# Altium project BLE_PGN.PrjPcb
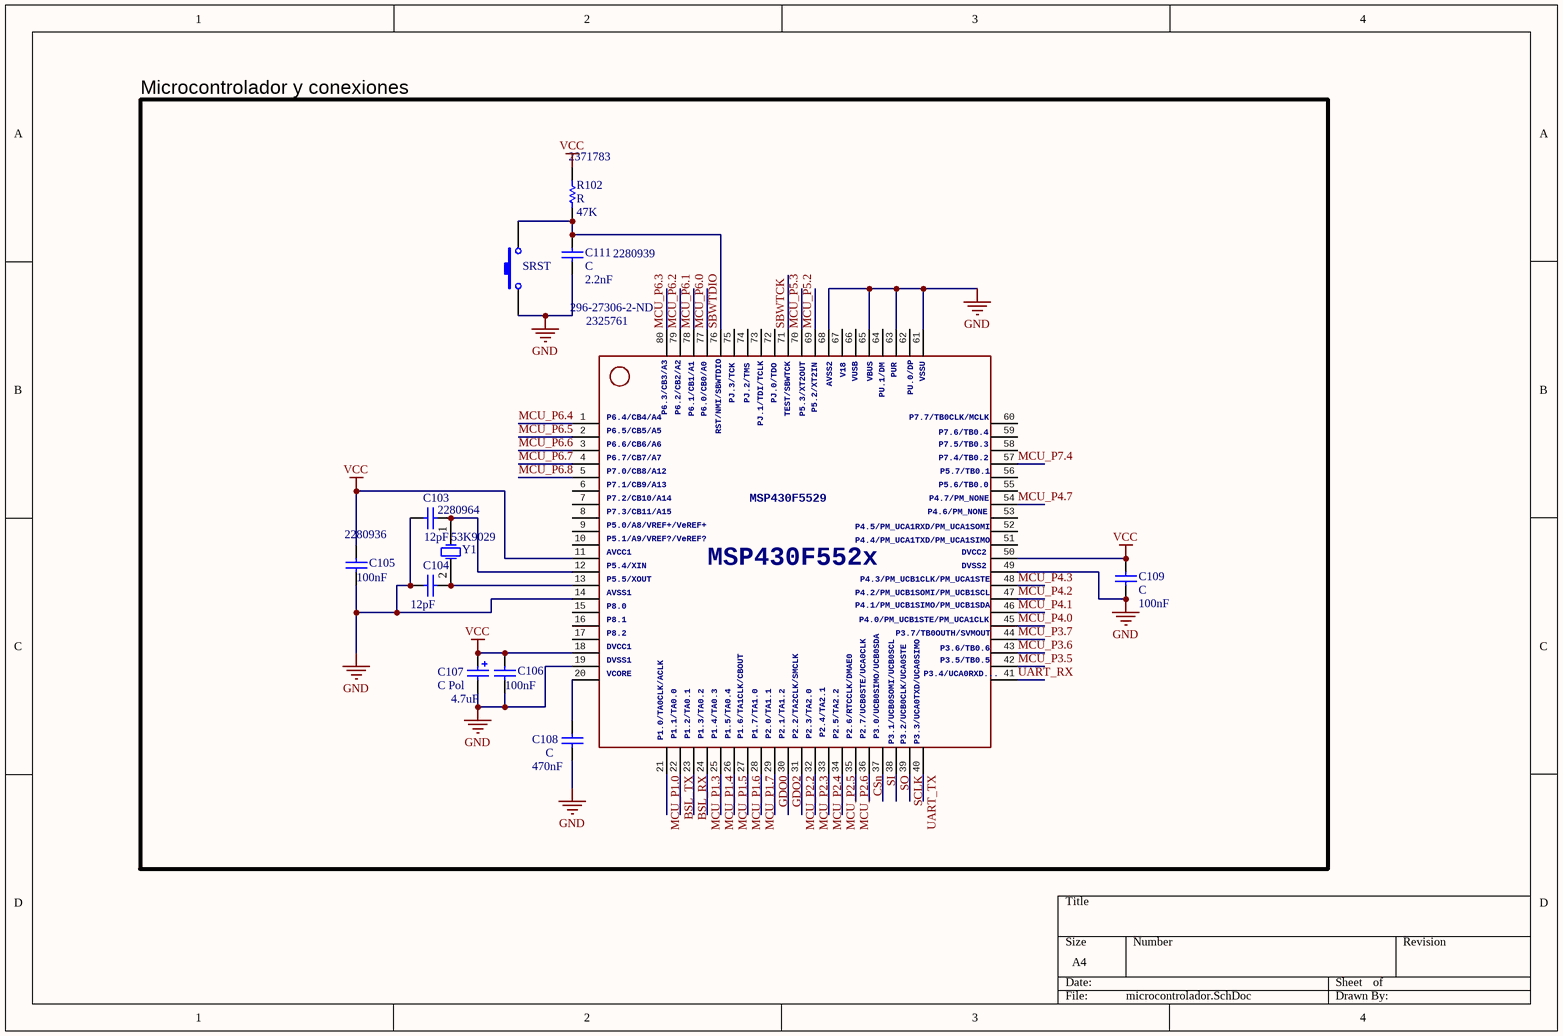
[diagram p0: microcontrolador.SchDoc]
5 sheets, 66 parts. Net scope: global (net labels, ports and power ports of the same name join across sheets).
Board file: blePGN.PcbDoc
Sheets:
  microcontrolador.SchDoc
  alimentacion.SchDoc
  headers_botones.SchDoc
  moduloTransceptorRF.SchDoc
  hm10.SchDoc

## Sheet microcontrolador.SchDoc
size A4

### Parts
C103  value 12pF  Supplier Part Number 1: 2280964  [0805 CAP]  (hidden comment: C)
C104  value 12pF  [0805 CAP]  (hidden comment: C)
C105  value 100nF  Supplier Part Number 2: 2280936  [0805 CAP]  (hidden comment: C)
C106  value 100nF  [0805 CAP]  (hidden comment: C)
C107  C Pol  value 4.7uF  [0805]
C108  C  value 470nF  [0805 CAP]
C109  C  value 100nF  [0805 CAP]
C111  C  value 2.2nF  Supplier Part Number 1: 2280939  [0805 CAP]
MSP430F5529  P3.4/UCA...: P3.4/UCA0RXD...  Supplier Part Number 1: 2325761  Supplier Part Number 2: 296-27306-2-ND  [TI-PN80_N]  (hidden comment: MSP430F5529IPNR)
R102  R  value 47K  Supplier Part Number 1: 2371783  [0805 RES]
SRST  Pulsador  [B3U-1000P]  (value not drawn)
Y1  Supplier Part Number 1: 53K9029  [R38]  (hidden comment: XTAL_CFPX-157_32.768K_SMD)

### Blocks framed on the sheet
Microcontrolador y conexiones: C103-C109 C111 MSP430F5529 R102 SRST Y1

### Nets
GND: C103.1 C104.1 C105.2 C106.2 C107.2 C108.1 C109.1 C111.1 MSP430F5529.14 MSP430F5529.19 MSP430F5529.49 MSP430F5529.61 MSP430F5529.63 MSP430F5529.65 MSP430F5529.68 SRST.1
VCC: C105.1 C106.1 C107.1 C109.2 MSP430F5529.11 MSP430F5529.18 MSP430F5529.50 R102.2
BSL_RX: MSP430F5529.23
BSL_TX: MSP430F5529.22
CSn: MSP430F5529.36
GDO0: MSP430F5529.29
GDO2: MSP430F5529.30
MCU_P1.0: MSP430F5529.21
MCU_P1.3: MSP430F5529.24
MCU_P1.4: MSP430F5529.25
MCU_P1.5: MSP430F5529.26
MCU_P1.6: MSP430F5529.27
MCU_P1.7: MSP430F5529.28
MCU_P2.2: MSP430F5529.31
MCU_P2.3: MSP430F5529.32
MCU_P2.4: MSP430F5529.33
MCU_P2.5: MSP430F5529.34
MCU_P2.6: MSP430F5529.35
MCU_P3.5: MSP430F5529.42
MCU_P3.6: MSP430F5529.43
MCU_P3.7: MSP430F5529.44
MCU_P4.0: MSP430F5529.45
MCU_P4.1: MSP430F5529.46
MCU_P4.2: MSP430F5529.47
MCU_P4.3: MSP430F5529.48
MCU_P4.7: MSP430F5529.54
MCU_P5.2: MSP430F5529.69
MCU_P5.3: MSP430F5529.70
MCU_P6.0: MSP430F5529.77
MCU_P6.1: MSP430F5529.78
MCU_P6.2: MSP430F5529.79
MCU_P6.3: MSP430F5529.80
MCU_P6.4: MSP430F5529.1
MCU_P6.5: MSP430F5529.2
MCU_P6.6: MSP430F5529.3
MCU_P6.7: MSP430F5529.4
MCU_P6.8: MSP430F5529.5
MCU_P7.4: MSP430F5529.57
SBWTCK: MSP430F5529.71
SBWTDIO: C111.2 MSP430F5529.76 R102.1 SRST.2
SCLK: MSP430F5529.39
SI: MSP430F5529.37
SO: MSP430F5529.38
UART_RX: MSP430F5529.41
UART_TX: MSP430F5529.40
NetC103_2: C103.2 MSP430F5529.12 Y1.1(OSC1)
NetC104_2: C104.2 MSP430F5529.13 Y1.2(OSC2)
NetC108_2: C108.2 MSP430F5529.20

Not connected (* = marked no-connect by the designer): MSP430F5529 6 7 8 9 10 15 16 17 51 52 53 55 56 58 59 60 62 64 66 67 72 73 74 75

### Library data of the parts
C103-C106 C108 C109 C111 = C: Capacitor; Manufacturer: Generic Components; Class: Passive; Published: 08/06/2000; Publisher: Altium Hobart Technology Centre; SubClass: Capacitor
  C103 C111: Supplier 1: Farnell
  C105: Supplier 1: Farnell; Supplier 2: Farnell
C107 = C Pol: Polarized Capacitor (Surface Mount); Manufacturer: Generic Components; Class: Passive; Published: 08/06/2000; Publisher: Altium Hobart Technology Centre; SubClass: Capacitor
MSP430F5529 = F552X---PN80: ***MSP430F552X***PN80 / http://www.ti.com/lit/gpn/msp430f5529 / Rev1.0 06/2010    For F552X where X is 1,5,7,9; P6.3/CB3/A3: P6.3/CB3/A3; P6.2/CB2/A2: P6.2/CB2/A2; P6.1/CB1/A1: P6.1/CB1/A1; P6.0/CB0/A0: P6.0/CB0/A0; PJ.3/TCK: PJ.3/TCK; PJ.2/TMS: PJ.2/TMS; PJ.1/TDI/TCLK: PJ.1/TDI/TCLK; PJ.0/TDO: PJ.0/TDO; TEST/SBWTCK: TEST/SBWTCK; P5.3/XT2OUT: P5.3/XT2OUT; P5.2/XT2IN: P5.2/XT2IN; AVSS2: AVSS2; V18: V18; VUSB: VUSB; VBUS: VBUS; PU.1/DM: PU.1/DM; PUR: PUR; PU.0/DP: PU.0/DP; VSSU: VSSU; RST/NMI/SBWTDIO: RST/NMI/SBWTDIO; P7.7/TB0CLK/MCLK: P7.7/TB0CLK/MCLK; P7.6/TB0.4: P7.6/TB0.4; P7.5/TB0.3: P7.5/TB0.3; P7.4/TB0.2: P7.4/TB0.2; P5.7/TB0.1: P5.7/TB0.1; P5.6/TB0.0: P5.6/TB0.0; P4.7/PM_NONE: P4.7/PM_NONE; P4.5/PM_UCA1RXD/PM_UCA1SOMI: P4.5/PM_UCA1RXD/PM_UCA1SOMI; P4.4/PM_UCA1TXD/PM_UCA1SIMO: P4.4/PM_UCA1TXD/PM_UCA1SIMO; DVCC2: DVCC2; P4.3/PM_UCB1CLK/PM_UCA1STE: P4.3/PM_UCB1CLK/PM_UCA1STE; P4.2/PM_UCB1SOMI/PM_UCB1SCL: P4.2/PM_UCB1SOMI/PM_UCB1SCL; P4.1/PM_UCB1SIMO/PM_UCB1SDA: P4.1/PM_UCB1SIMO/PM_UCB1SDA; P4.0/PM_UCB1STE/PM_UCA1CLK: P4.0/PM_UCB1STE/PM_UCA1CLK; P3.7/TB0OUTH/SVMOUT: P3.7/TB0OUTH/SVMOUT; P3.6/TB0.6: P3.6/TB0.6; P4.6/PM_NONE: P4.6/PM_NONE; P3.5/TB0.5: P3.5/TB0.5; P1.0/TA0CLK/ACLK: P1.0/TA0CLK/ACLK; P1.1/TA0.0: P1.1/TA0.0; P1.2/TA0.1: P1.2/TA0.1; P1.3/TA0.2: P1.3/TA0.2; P1.4/TA0.3: P1.4/TA0.3; P1.5/TA0.4: P1.5/TA0.4; P1.6/TA1CLK/CBOUT: P1.6/TA1CLK/CBOUT; P1.7/TA1.0: P1.7/TA1.0; P2.0/TA1.1: P2.0/TA1.1; P2.1/TA1.2: P2.1/TA1.2; P2.2/TA2CLK/SMCLK: P2.2/TA2CLK/SMCLK; P2.4/TA2.1: P2.4/TA2.1; P2.5/TA2.2: P2.5/TA2.2; P2.6/RTCCLK/DMAE0: P2.6/RTCCLK/DMAE0; P2.7/UCB0STE/UCA0CLK: P2.7/UCB0STE/UCA0CLK; P3.0/UCB0SIMO/UCB0SDA: P3.0/UCB0SIMO/UCB0SDA; P3.1/UCB0SOMI/UCB0SCL: P3.1/UCB0SOMI/UCB0SCL; P3.2/UCB0CLK/UCA0STE: P3.2/UCB0CLK/UCA0STE; P3.3/UCA0TXD/UCA0SIMO: P3.3/UCA0TXD/UCA0SIMO; P6.4/CB4/A4: P6.4/CB4/A4; P6.5/CB5/A5: P6.5/CB5/A5; P6.6/CB6/A6: P6.6/CB6/A6; P6.7/CB7/A7: P6.7/CB7/A7; P7.0/CB8/A12: P7.0/CB8/A12; P7.1/CB9/A13: P7.1/CB9/A13; P7.2/CB10/A14: P7.2/CB10/A14; P7.3/CB11/A15: P7.3/CB11/A15; P5.0/A8/VREF+/VeREF+: P5.0/A8/VREF+/VeREF+; P5.1/A9/VREF?/VeREF?: P5.1/A9/VREF?/VeREF?; AVCC1: AVCC1; P5.4/XIN: P5.4/XIN; P5.5/XOUT: P5.5/XOUT; AVSS1: AVSS1; P8.0: P8.0; P8.1: P8.1; P8.2: P8.2; DVCC1: DVCC1; DVSS1: DVSS1; VCORE: VCORE; MSP430F552x: MSP430F552x; DVSS2: DVSS2; P2.3/TA2.0: P2.3/TA2.0; Supplier 1: Farnell; Supplier 2: Digi-Key
R102 = R: Resistor; Manufacturer: Generic Components; Class: Passive; Published: 08/06/2000; Publisher: Altium Hobart Technology Centre; SubClass: Resistor; Supplier 1: Farnell
SRST = Pulsador_1: Switch; Manufacturer: Generic Components; Published: 1999
Y1 = XTAL_CFPX-157_32.768K_SMD: Crystal Oscillator; Manufacturer: Generic Components; Published: 08/06/2000; Publisher: Altium Hobart Technology Centre; Class: Oscillator; SubClass: Crystal Oscillator; Supplier 1: Newark

## Sheet alimentacion.SchDoc
size A4
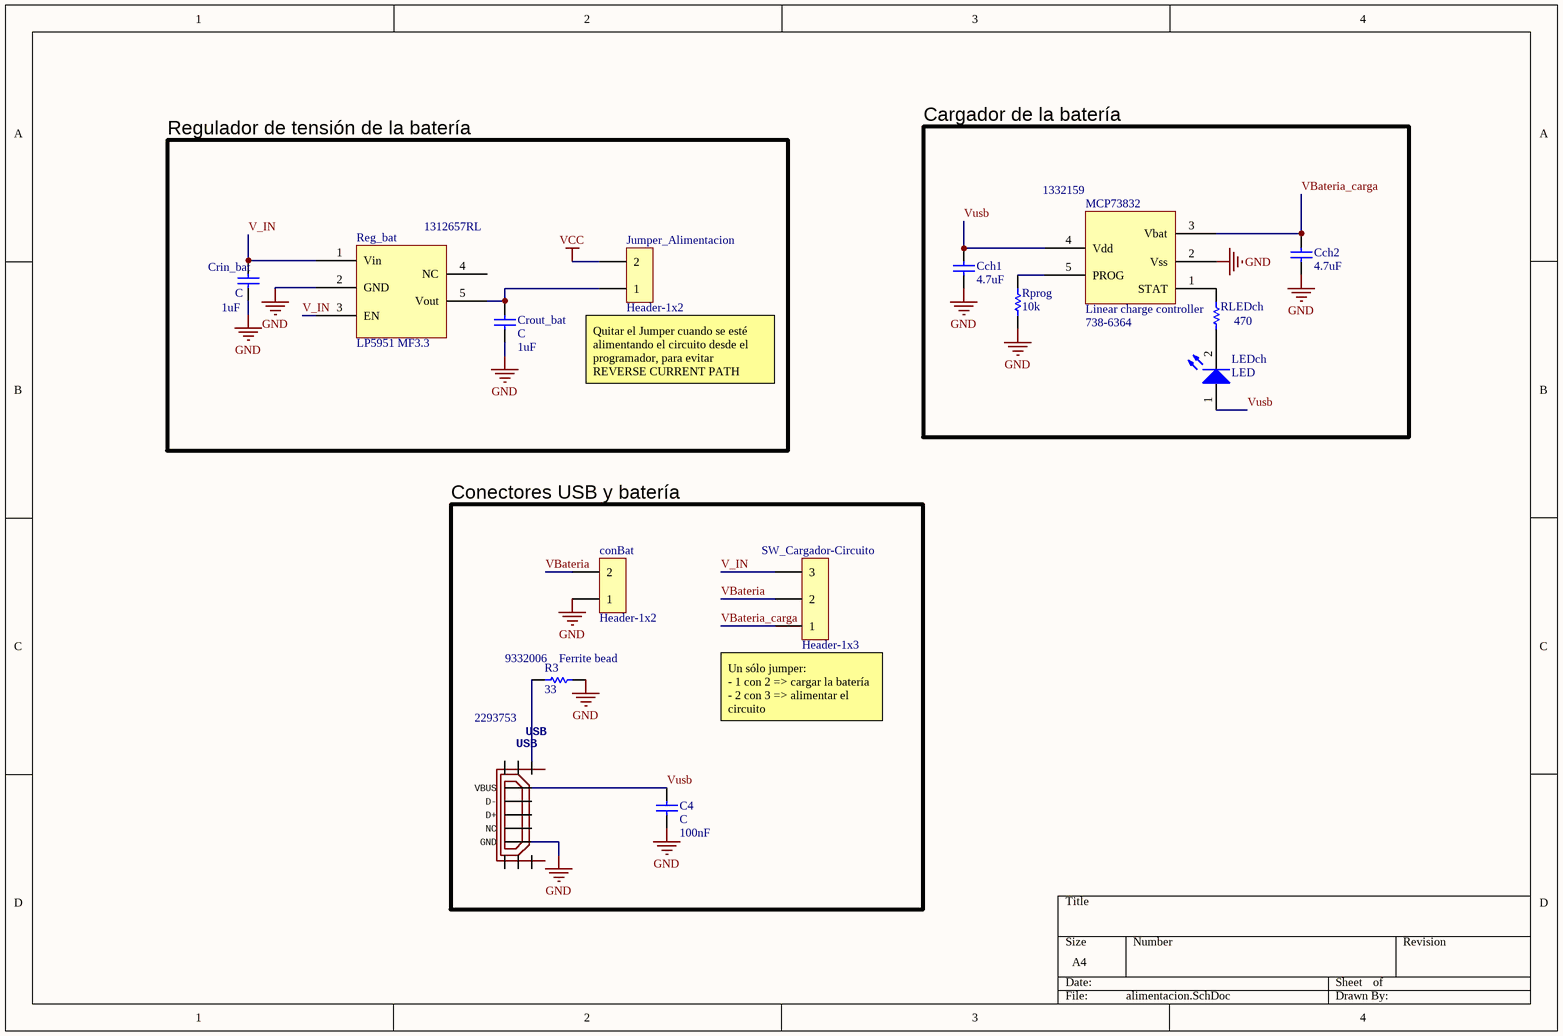
[diagram p1: alimentacion.SchDoc]

### Parts
C4  C  value 100nF  [0805 CAP]
Cch1  value 4.7uF  [0805]  (hidden comment: C)
Cch2  value 4.7uF  [0805]  (hidden comment: C)
conBat  Header-1x2  [HEADER-1x2]
Crin_bat  C  value 1uF  [0805]
Crout_bat  C  value 1uF  [0805]
Jumper_Alimentacion  Header-1x2  [HEADER-1x2]
LEDch  LED  [0603 LED-RED]
MCP73832  Linear charge controller  Supplier Part Number 1: 738-6364  Supplier Part Number 2: 1332159  [SOT-23-5]
R3  Ferrite bead  value 33  Supplier Part Number 1: 9332006  [0805]
Reg_bat  LP5951 MF3.3  Supplier Part Number 1: 1312657RL  [SOT-23-5]
RLEDch  value 470  [0805]  (hidden comment: Res1)
Rprog  value 10k  [0805]  (hidden comment: Res1)
SW_Cargador-Circuito  Header-1x3  [Header-1x3-Jumper]
USB  USB  Supplier Part Number 1: 2293753  [HIROSE-ZX62R-B-5P]

### Blocks framed on the sheet
Cargador de la batería: Cch1 Cch2 LEDch MCP73832 RLEDch Rprog
Regulador de tensión de la batería: Crin_bat Crout_bat Jumper_Alimentacion Reg_bat
Conectores USB y batería: C4 conBat R3 SW_Cargador-Circuito USB

### Nets
GND: C4.1 Cch1.1 Cch2.1 conBat.1 Crin_bat.1 Crout_bat.1 MCP73832.2(Vss) R3.1 Reg_bat.2(GND) Rprog.2 USB.GND
VCC: Jumper_Alimentacion.2
V_IN: Crin_bat.2 Reg_bat.1(Vin) Reg_bat.3(EN) SW_Cargador-Circuito.3
VBateria: conBat.2 SW_Cargador-Circuito.2
VBateria_carga: Cch2.2 MCP73832.3(Vbat) SW_Cargador-Circuito.1
Vusb: C4.2 Cch1.2 LEDch.1(A) MCP73832.4(Vdd) USB.VBUS
NetCrout_bat_2: Crout_bat.2 Jumper_Alimentacion.1 Reg_bat.5(Vout)
NetLEDch_2: LEDch.2(C) RLEDch.1
NetMCP73832_1: MCP73832.1(STAT) RLEDch.2
NetMCP73832_5: MCP73832.5(PROG) Rprog.1
NetR3_2: R3.2 USB.SHIELD4

Not connected (* = marked no-connect by the designer): Reg_bat 4(NC); USB D+ D- NC SHIELD1 SHIELD2 SHIELD3 SHIELD5 SHIELD6

### Notes on the sheet
- (near Jumper_Alimentacion) Quitar el Jumper cuando se esté alimentando el circuito desde el programador, para evitar REVERSE CURRENT PATH
- (near SW_Cargador-Circuito) Un sólo jumper:
  - 1 con 2 => cargar la batería
  - 2 con 3 => alimentar el circuito

### Library data of the parts
C4 Cch1 Cch2 Crin_bat Crout_bat = C: as C103 on sheet microcontrolador; Published: 08/06/2000; Publisher: Altium Hobart Technology Centre; SubClass: Capacitor
MCP73832 = MCP73832: Linear charge controller SOT 235; Supplier 1: RS-Components; Supplier 2: Farnell
R3 = R: as R102 on sheet microcontrolador; Published: 08/06/2000; Publisher: Altium Hobart Technology Centre; SubClass: Resistor; Supplier 1: Farnell
Reg_bat = LP5951: TI Lineal Regulator SOT 235; Supplier 1: Farnell
RLEDch Rprog = Res1: Resistor; Published: 8-Jun-2000; LatestRevisionDate: 17-Jul-2002; LatestRevisionNote: Re-released for DXP Platform.; PackageReference: AXIAL-0.3; Publisher: Altium Limited; PackageDescription: Axial Device, Thru-Hole; 2 Leads; 0.3 in Pin Spacing
  Rprog: Supplier 1: Farnell
USB = USB_MICRO_FLIPPED: Supplier 1: Farnell

## Sheet headers_botones.SchDoc
size A4
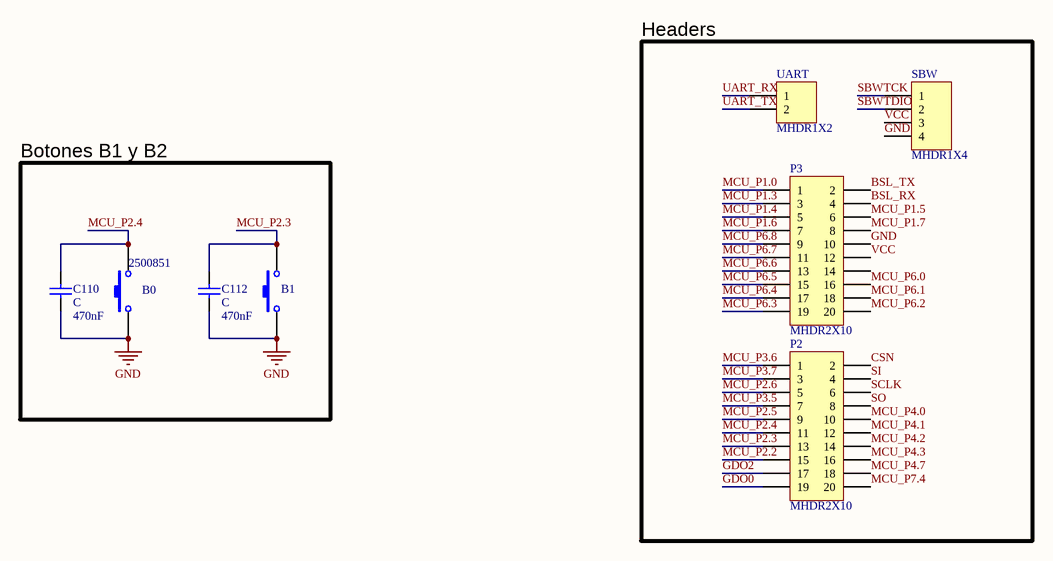
[diagram p2: headers_botones.SchDoc]

### Parts
B0  Supplier Part Number 1: 2500851  [PushButton]  (hidden comment: Pulsador)
B1  Pulsador  [pushbutton]  (value not drawn)
C110  C  value 470nF  [0805 CAP]
C112  C  value 470nF  [0805 CAP]
P2  MHDR2X10  [HDR2X10]
P3  MHDR2X10  [HDR2X10]
SBW  MHDR1X4  [HDR1X4]
UART  MHDR1X2  [HDR1X2]

### Blocks framed on the sheet
Headers: P2 P3 SBW UART
Botones B1 y B2: B0 B1 C110 C112

### Nets
GND: B0.1 B1.1 C110.1 C112.1 P3.10 SBW.4
VCC: P3.12 SBW.3
BSL_RX: P3.4
BSL_TX: P3.2
CSn: P2.2
GDO0: P2.19
GDO2: P2.17
MCU_P1.0: P3.1
MCU_P1.3: P3.3
MCU_P1.4: P3.5
MCU_P1.5: P3.6
MCU_P1.6: P3.7
MCU_P1.7: P3.8
MCU_P2.2: P2.15
MCU_P2.3: B1.2 C112.2 P2.13
MCU_P2.4: B0.2 C110.2 P2.11
MCU_P2.5: P2.9
MCU_P2.6: P2.5
MCU_P3.5: P2.7
MCU_P3.6: P2.1
MCU_P3.7: P2.3
MCU_P4.0: P2.10
MCU_P4.1: P2.12
MCU_P4.2: P2.14
MCU_P4.3: P2.16
MCU_P4.7: P2.18
MCU_P6.0: P3.16
MCU_P6.1: P3.18
MCU_P6.2: P3.20
MCU_P6.3: P3.19
MCU_P6.4: P3.17
MCU_P6.5: P3.15
MCU_P6.6: P3.13
MCU_P6.7: P3.11
MCU_P6.8: P3.9
MCU_P7.4: P2.20
SBWTCK: SBW.1
SBWTDIO: SBW.2
SCLK: P2.6
SI: P2.4
SO: P2.8
UART_RX: UART.1
UART_TX: UART.2

Not connected (* = marked no-connect by the designer): P3 14

### Library data of the parts
B0 B1 = Pulsador_1: Switch; Manufacturer: Generic Components; Published: 1999
  B0: Supplier 1: Farnell
C110 C112 = C: as C103 on sheet microcontrolador; Published: 08/06/2000; Publisher: Altium Hobart Technology Centre; SubClass: Capacitor
P2 P3 = MHDR2X10: Header, 10-Pin, Dual row; LatestRevisionDate: 17-Jul-2002; LatestRevisionNote: Re-released for DXP Platform.; Publisher: Altium Limited
SBW = MHDR1X4: Header, 4-Pin; LatestRevisionDate: 17-Jul-2002; LatestRevisionNote: Re-released for DXP Platform.; Publisher: Altium Limited
UART = MHDR1X2: Header, 2-Pin; LatestRevisionDate: 17-Jul-2002; LatestRevisionNote: Re-released for DXP Platform.; Publisher: Altium Limited

## Sheet moduloTransceptorRF.SchDoc
size A4
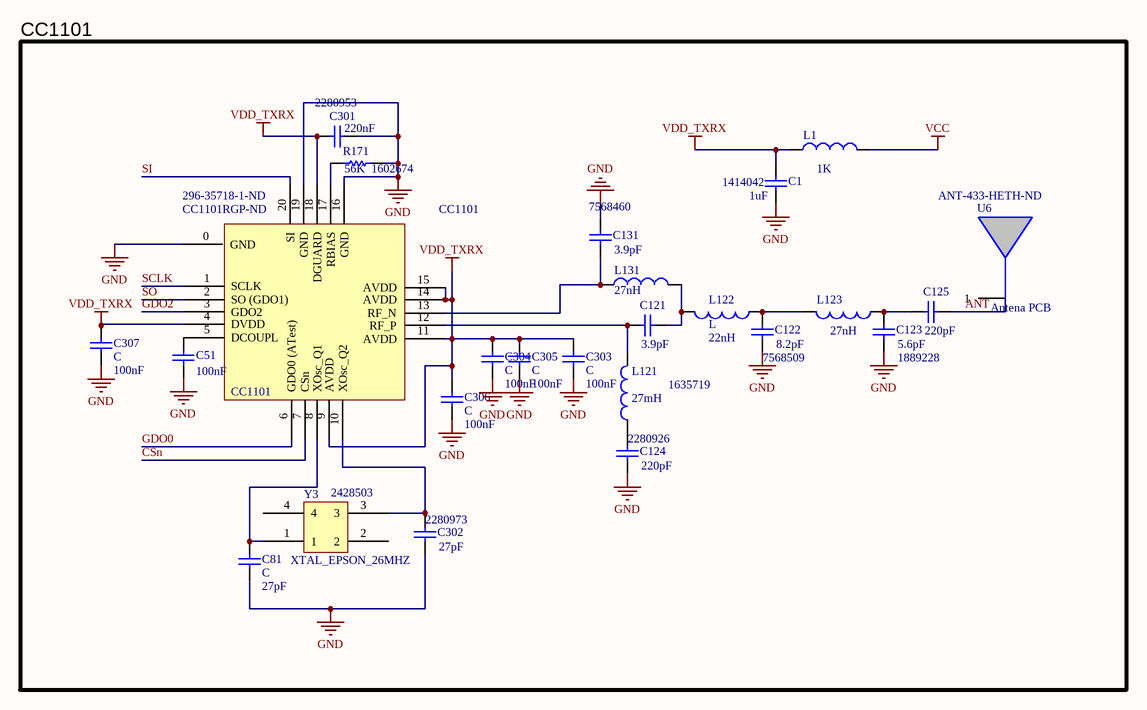
[diagram p3: moduloTransceptorRF.SchDoc]

### Parts
C1  value 1uF  Supplier Part Number 3: 1414042  [0805 CAP]  (hidden comment: C)
C51  value 100nF  [0805 CAP]  (hidden comment: C)
C81  C  value 27pF  [0805 CAP]
C121  value 3.9pF  [0805 CAP]  (hidden comment: C)
C122  value 8.2pF  Supplier Part Number 1: 7568509  [0805 CAP]  (hidden comment: C)
C123  value 5.6pF  Supplier Part Number 1: 1889228  [0805 CAP]  (hidden comment: C)
C124  value 220pF  Supplier Part Number 1: 2280926  [0805 CAP]  (hidden comment: C)
C125  value 220pF  [0805 CAP]  (hidden comment: C)
C131  value 3.9pF  Supplier Part Number 1: 7568460  [0805 CAP]  (hidden comment: C)
C301  value 220nF  Supplier Part Number 1: 2280953  [0805 CAP]  (hidden comment: C)
C302  value 27pF  Supplier Part Number 1: 2280973  [0805 CAP]  (hidden comment: C)
C303  C  value 100nF  [0805 CAP]
C304  C  value 100nF  [0805 CAP]
C305  C  value 100nF  [0805 CAP]
C306  C  value 100nF  [0805 CAP]
C307  C  value 100nF  [0805 CAP]
CC1101  Supplier Part Number 1: CC1101RGP-ND  Supplier Part Number 2: 296-35718-1-ND  [CC1101]  (hidden comment: CC1101 Transceiver)
L1  value 1K  [0805 Ind]  (hidden comment: L)
L121  value 27mH  Supplier Part Number 1: 1635719  [0805 Ind]  (hidden comment: L)
L122  L  value 22nH  [0805 Ind]
L123  value 27nH  [0805 Ind]  (hidden comment: L)
L131  value 27nH  [0805 Ind]  (hidden comment: L)
R171  value 56K  Supplier Part Number 1: 1602674  [0805 RES]  (hidden comment: R)
U6  Antena PCB  Supplier Part Number 1: ANT-433-HETH-ND  [ANT-433-HETH]
Y3  XTAL_EPSON_26MHZ  Supplier Part Number 1: 2428503  [XTAL_EPSON_26MHZ]

### Blocks framed on the sheet
CC1101: C1 C51 C81 C121-C125 C131 C301-C307 CC1101 L1 L121-L123 L131 R171 U6 Y3

### Nets
GND: C1.1 C51.1 C81.1 C122.1 C123.1 C124.1 C131.2 C301.2 C302.1 C303.1 C304.1 C305.1 C306.1 C307.1 CC1101.0(GND) CC1101.16(GND) CC1101.19(GND) R171.1
VCC: L1.2
VDD_TXRX: C1.2 C301.1 C303.2 C304.2 C305.2 C306.2 C307.2 CC1101.4(DVDD) CC1101.9(AVDD) CC1101.11(AVDD) CC1101.14(AVDD) CC1101.15(AVDD) CC1101.18(DGUARD) L1.1
ANT: C125.2 U6.1
CSn: CC1101.7(CSn)
GDO0: CC1101.6(GDO0_(ATest))
GDO2: CC1101.3(GDO2)
SCLK: CC1101.1(SCLK)
SI: CC1101.20(SI)
SO: CC1101.2(SO_(GDO1))
NetC51_2: C51.2 CC1101.5(DCOUPL)
NetC81_2: C81.2 CC1101.8(XOsc_Q1) Y3.1
NetC121_1: C121.1 CC1101.12(RF_P) L121.2
NetC121_2: C121.2 L122.2 L131.2
NetC122_2: C122.2 L122.1 L123.2
NetC123_2: C123.2 C125.1 L123.1
NetC124_2: C124.2 L121.1
NetC131_1: C131.1 CC1101.13(RF_N) L131.1
NetC302_2: C302.2 CC1101.10(XOsc_Q2) Y3.3
NetCC1101_17: CC1101.17(RBIAS) R171.2

Not connected (* = marked no-connect by the designer): Y3 2 4

### Library data of the parts
C1 C51 C81 C121-C125 C131 C301-C307 = C: as C103 on sheet microcontrolador; Published: 08/06/2000; Publisher: Altium Hobart Technology Centre; SubClass: Capacitor
  C1: Supplier 1: Digi-Key; Supplier 2: Farnell; Supplier 3: Farnell
  C122-C125 C131 C301 C302: Supplier 1: Farnell
L1 L121-L123 L131 = L: Inductor; Manufacturer: Generic Components; Class: Passive; Published: 08/06/2000; Publisher: Altium Hobart Technology Centre; SubClass: Inductor
  L121: Supplier 1: Farnell
R171 = R: as R102 on sheet microcontrolador; Published: 08/06/2000; Publisher: Altium Hobart Technology Centre; SubClass: Resistor; Supplier 1: Farnell
U6 = Antena PCB: Note: Not recommended for new designs. Consider PIC16C72A or PIC16F72 instead.; Published: 8-Jun-2000; LatestRevisionDate: 13-Apr-2006; LatestRevisionNote: IPC-7351 Footprint Added.; DatasheetVersion: DS39016A_1998; PackageVersion: 2005; PackageReference: SOIC300-28; Publisher: Altium Limited; PackageDescription: 28-Pin Small Outline Integrated Circuit 1.27 mm Pitch; Code_JEDEC: MS-013; ComponentLink1Description: Manufacturer Link; ComponentLink1URL: http://www.microchip.com; ComponentLink2Description: Datasheet; ComponentLink2URL: http://ww1.microchip.com/downloads/en/DeviceDoc/39016a.pdf; ComponentLink3Description: Packaging Specification; ComponentLink3URL: http://ww1.microchip.com/downloads/en/PackagingSpec/00049AD.pdf; Supplier 1: Digi-Key
Y3 = XTAL_EPSON_26MHZ: Pin 2 and 4 to ground; Supplier 1: Farnell
CC1101 = CC1101 Transceiver: Supplier 1: Digi-Key; Supplier 2: Digi-Key

## Sheet hm10.SchDoc
size A4
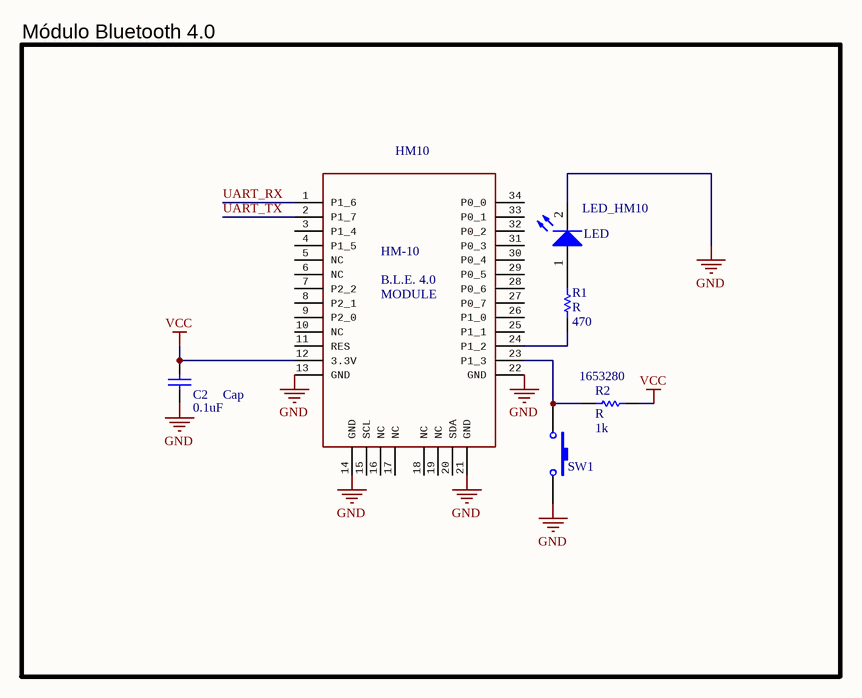
[diagram p4: hm10.SchDoc]

### Parts
C2  Cap  value 0.1uF  [0805]
HM10  HM-10 Module  [HM-10 module]  (value not drawn)
LED_HM10  LED  [0603 LED-RED]
R1  R  value 470  [0805 RES]
R2  R  value 1k  Supplier Part Number 1: 1653280  [0805 RES]
SW1  Pulsador  [B3U-1000P]  (value not drawn)

### Blocks framed on the sheet
Módulo Bluetooth 4.0: C2 HM10 LED_HM10 R1 R2 SW1

### Nets
GND: C2.1 HM10.13(GND) HM10.14(GND) HM10.21(GND) HM10.22(GND) LED_HM10.2(C) SW1.2
VCC: C2.2 HM10.12(3.3V) R2.2
UART_RX: HM10.1(P1_6)
UART_TX: HM10.2(P1_7)
NetHM10_23: HM10.23(P1_3) R2.1 SW1.1
NetHM10_24: HM10.24(P1_2) R1.2
NetLED_HM10_1: LED_HM10.1(A) R1.1

Not connected (* = marked no-connect by the designer): HM10 3(P1_4) 4(P1_5) 5(NC) 6(NC) 7(P2_2) 8(P2_1) 9(P2_0) 10(NC) 11(RES) 15(SCL) 16(NC) 17(NC) 18(NC) 19(NC) 20(SDA) 25(P1_1) 26(P1_0) 27(P0_7) 28(P0_6) 29(P0_5) 30(P0_4) 31(P0_3) 32(P0_2) 33(P0_1) 34(P0_0)

### Notes on the sheet
- (in symbol HM-10 Module) HM-10; B.L.E. 4.0; MODULE

### Library data of the parts
C2 = Cap: Capacitor; Published: 8-Jun-2000; LatestRevisionDate: 17-Jul-2002; LatestRevisionNote: Re-released for DXP Platform.; PackageReference: RAD-0.3; Publisher: Altium Limited; PackageDescription: Radial Cap, Thru-Hole; 2 Leads; 0.3 in Pin Spacing
R1 R2 = R: as R102 on sheet microcontrolador; Published: 08/06/2000; Publisher: Altium Hobart Technology Centre; SubClass: Resistor
  R2: Supplier 1: Farnell
SW1 = Pulsador_1: Switch; Manufacturer: Generic Components; Published: 1999

## Nets that join several sheets
GND: microcontrolador (16 pins), alimentacion (11 pins), headers_botones (6 pins), moduloTransceptorRF (18 pins), hm10 (7 pins)
VCC: microcontrolador (8 pins), alimentacion (Jumper_Alimentacion.2), headers_botones (P3.12 SBW.3), moduloTransceptorRF (L1.2), hm10 (C2.2 HM10.12 R2.2)
BSL_RX: microcontrolador (MSP430F5529.23), headers_botones (P3.4)
BSL_TX: microcontrolador (MSP430F5529.22), headers_botones (P3.2)
CSn: microcontrolador (MSP430F5529.36), headers_botones (P2.2), moduloTransceptorRF (CC1101.7)
GDO0: microcontrolador (MSP430F5529.29), headers_botones (P2.19), moduloTransceptorRF (CC1101.6)
GDO2: microcontrolador (MSP430F5529.30), headers_botones (P2.17), moduloTransceptorRF (CC1101.3)
MCU_P1.0: microcontrolador (MSP430F5529.21), headers_botones (P3.1)
MCU_P1.3: microcontrolador (MSP430F5529.24), headers_botones (P3.3)
MCU_P1.4: microcontrolador (MSP430F5529.25), headers_botones (P3.5)
MCU_P1.5: microcontrolador (MSP430F5529.26), headers_botones (P3.6)
MCU_P1.6: microcontrolador (MSP430F5529.27), headers_botones (P3.7)
MCU_P1.7: microcontrolador (MSP430F5529.28), headers_botones (P3.8)
MCU_P2.2: microcontrolador (MSP430F5529.31), headers_botones (P2.15)
MCU_P2.3: microcontrolador (MSP430F5529.32), headers_botones (B1.2 C112.2 P2.13)
MCU_P2.4: microcontrolador (MSP430F5529.33), headers_botones (B0.2 C110.2 P2.11)
MCU_P2.5: microcontrolador (MSP430F5529.34), headers_botones (P2.9)
MCU_P2.6: microcontrolador (MSP430F5529.35), headers_botones (P2.5)
MCU_P3.5: microcontrolador (MSP430F5529.42), headers_botones (P2.7)
MCU_P3.6: microcontrolador (MSP430F5529.43), headers_botones (P2.1)
MCU_P3.7: microcontrolador (MSP430F5529.44), headers_botones (P2.3)
MCU_P4.0: microcontrolador (MSP430F5529.45), headers_botones (P2.10)
MCU_P4.1: microcontrolador (MSP430F5529.46), headers_botones (P2.12)
MCU_P4.2: microcontrolador (MSP430F5529.47), headers_botones (P2.14)
MCU_P4.3: microcontrolador (MSP430F5529.48), headers_botones (P2.16)
MCU_P4.7: microcontrolador (MSP430F5529.54), headers_botones (P2.18)
MCU_P6.0: microcontrolador (MSP430F5529.77), headers_botones (P3.16)
MCU_P6.1: microcontrolador (MSP430F5529.78), headers_botones (P3.18)
MCU_P6.2: microcontrolador (MSP430F5529.79), headers_botones (P3.20)
MCU_P6.3: microcontrolador (MSP430F5529.80), headers_botones (P3.19)
MCU_P6.4: microcontrolador (MSP430F5529.1), headers_botones (P3.17)
MCU_P6.5: microcontrolador (MSP430F5529.2), headers_botones (P3.15)
MCU_P6.6: microcontrolador (MSP430F5529.3), headers_botones (P3.13)
MCU_P6.7: microcontrolador (MSP430F5529.4), headers_botones (P3.11)
MCU_P6.8: microcontrolador (MSP430F5529.5), headers_botones (P3.9)
MCU_P7.4: microcontrolador (MSP430F5529.57), headers_botones (P2.20)
SBWTCK: microcontrolador (MSP430F5529.71), headers_botones (SBW.1)
SBWTDIO: microcontrolador (C111.2 MSP430F5529.76 R102.1 SRST.2), headers_botones (SBW.2)
SCLK: microcontrolador (MSP430F5529.39), headers_botones (P2.6), moduloTransceptorRF (CC1101.1)
SI: microcontrolador (MSP430F5529.37), headers_botones (P2.4), moduloTransceptorRF (CC1101.20)
SO: microcontrolador (MSP430F5529.38), headers_botones (P2.8), moduloTransceptorRF (CC1101.2)
UART_RX: microcontrolador (MSP430F5529.41), headers_botones (UART.1), hm10 (HM10.1)
UART_TX: microcontrolador (MSP430F5529.40), headers_botones (UART.2), hm10 (HM10.2)